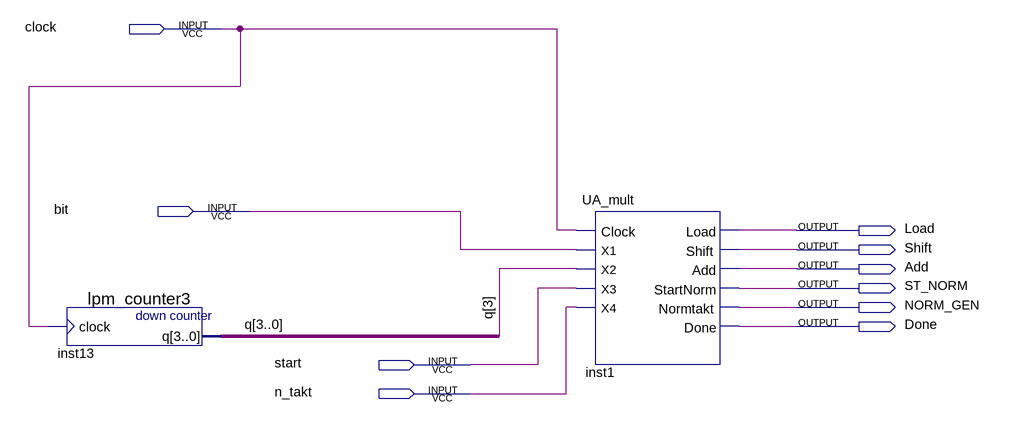
[diagram p0: schematic sheet]
// Quartus schematic P_UA.bdf as structural Verilog: 2 symbols, 10 pins
module P_UA (
  input  clock,
  input  \bit ,
  input  start,
  input  n_takt,
  output Load,
  output Shift,
  output Add,
  output ST_NORM,
  output NORM_GEN,
  output Done
);

  wire [3:0] q;

  lpm_counter3 inst13 (.clock(clock), .q(q));
  UA_mult inst1 (
    .Clock(clock), .X1(\bit ), .X2(q[3]), .X3(start), .X4(n_takt), .Load(Load), .Shift(Shift), .Add(Add),
    .StartNorm(ST_NORM), .Normtakt(NORM_GEN), .Done(Done));
endmodule
